# EasyEDA Pro project CH32V203 DOUBLE-FOC.epro, schematic Schematic1

## Sheets
1 P1: Board Name: CH32V203C8T6无刷双驱; Create Date: 2025-08-31; Page Name: P1; Project Name: Project; Schematic Name: Schematic1; Update Date: 2025-09-06; Company: 嘉立创EDA; Page Size: A4; Version: V1.0
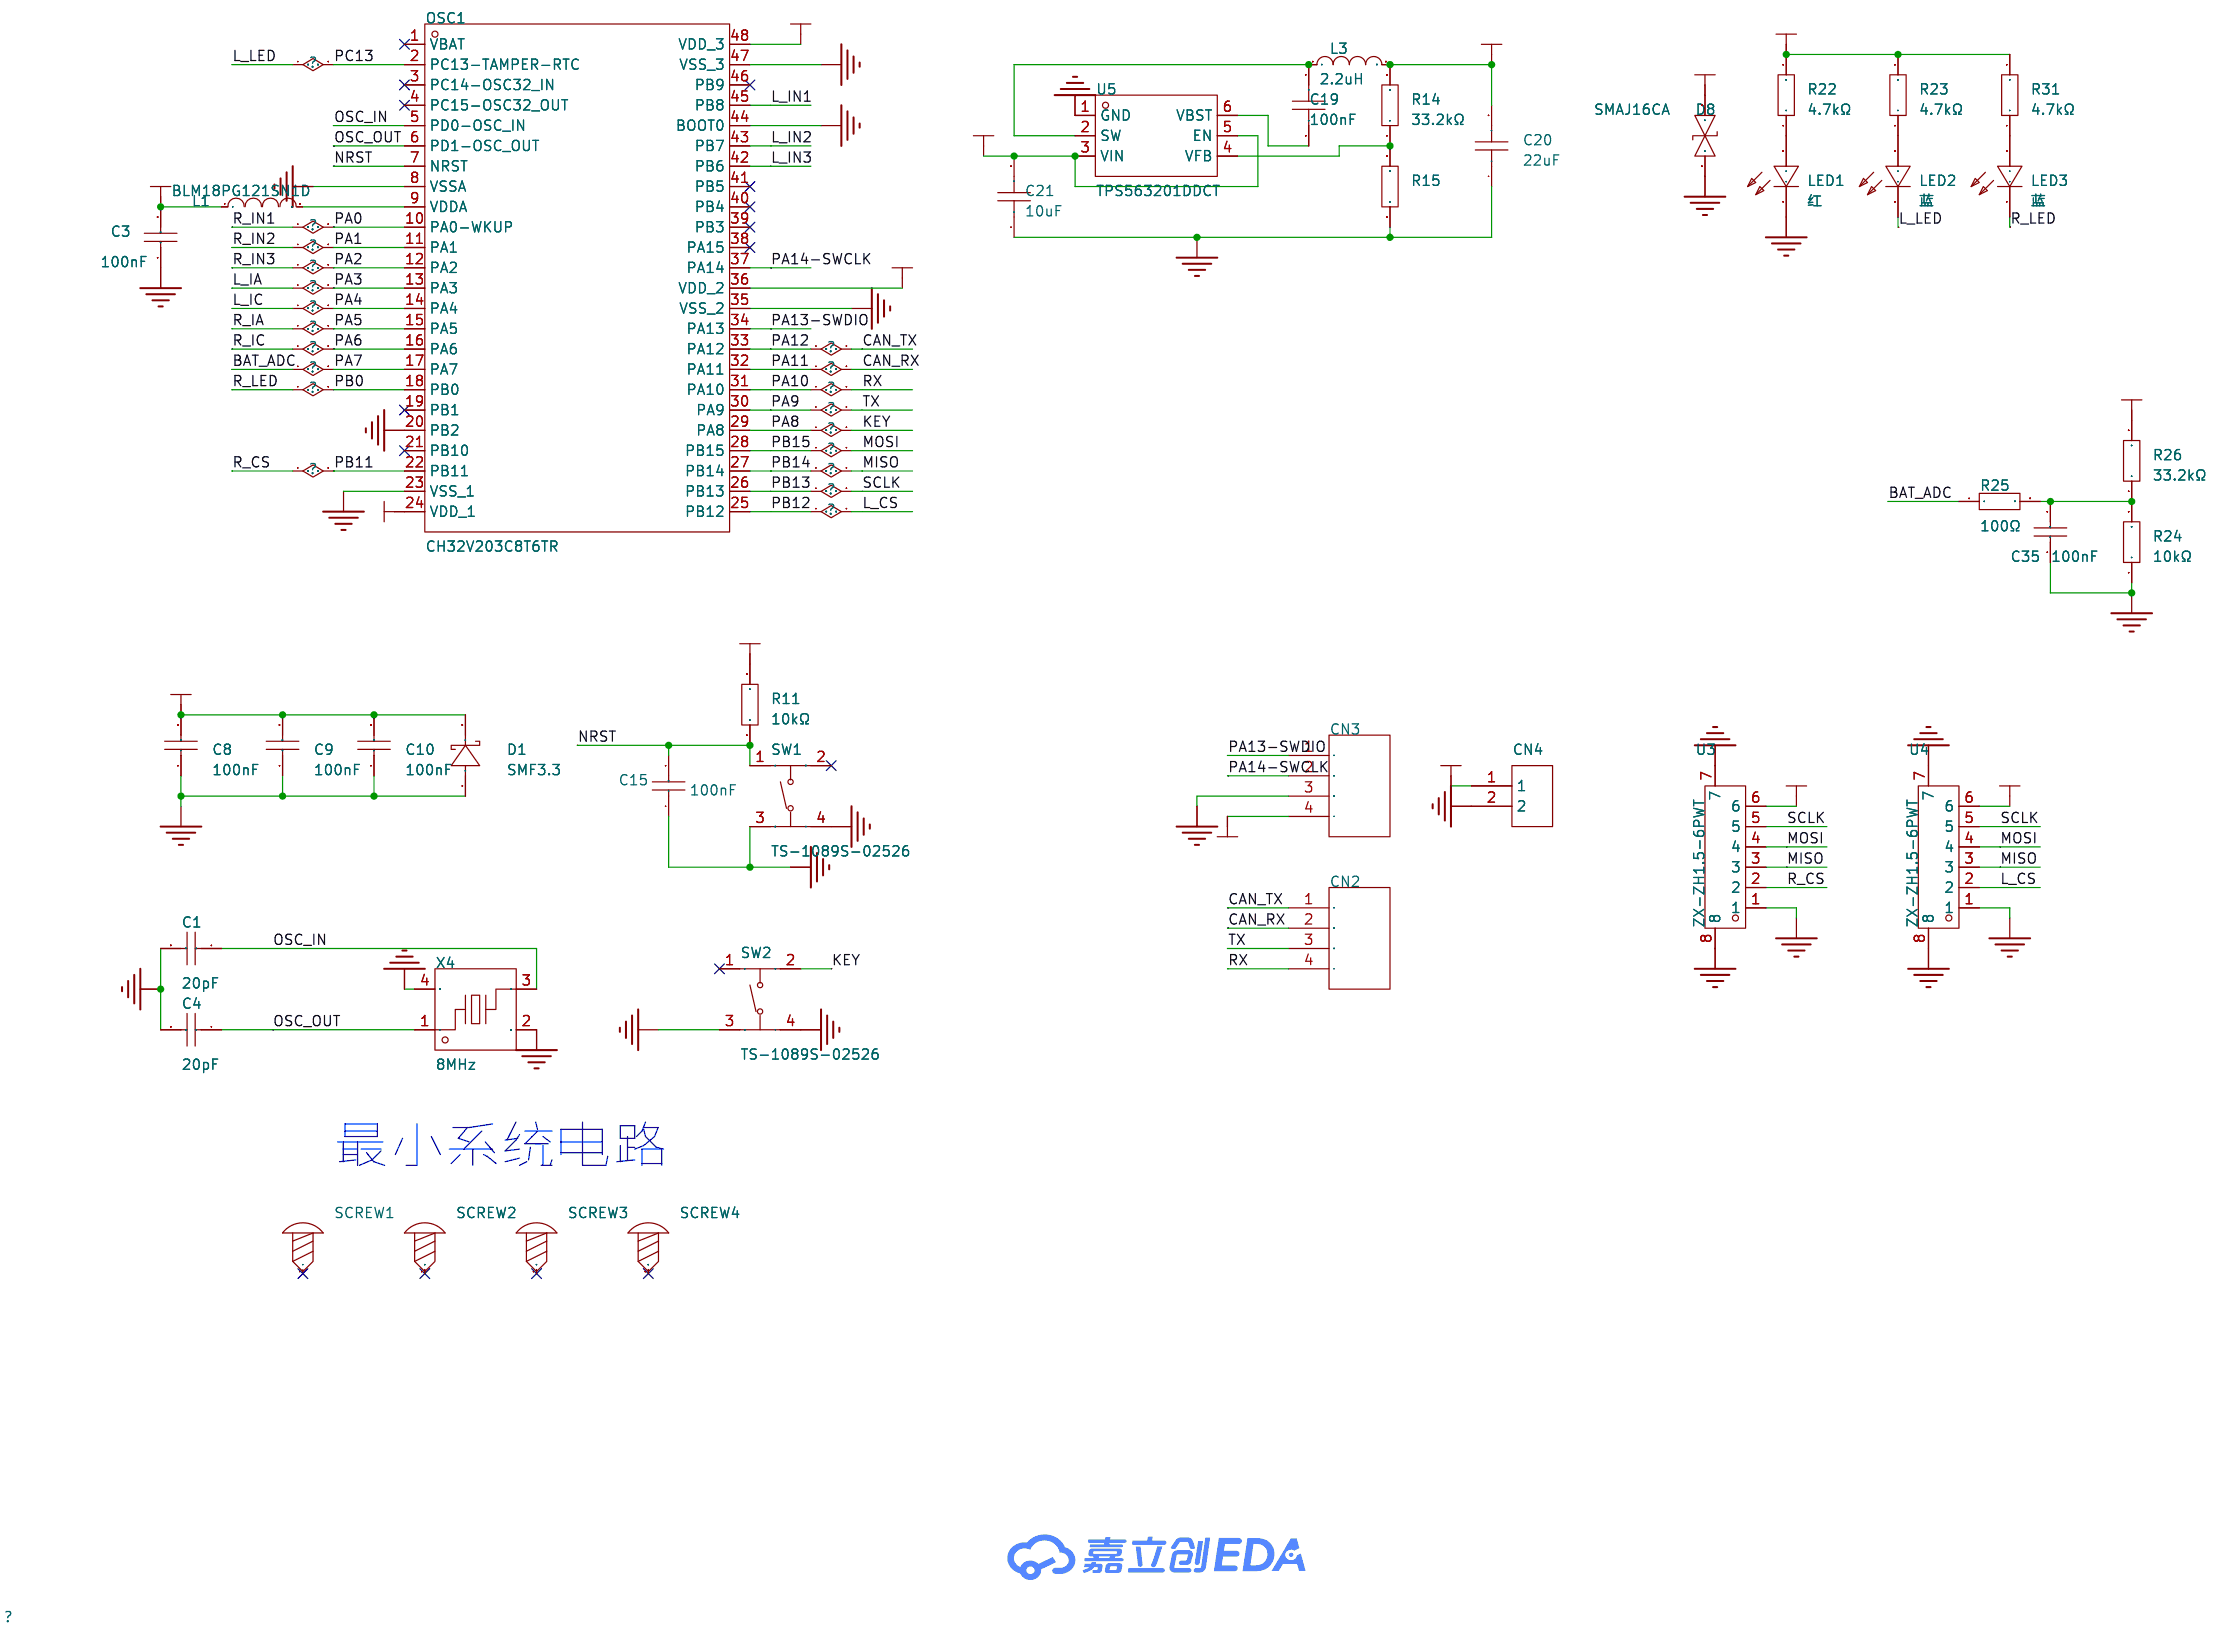
[diagram p0: P1]
2 P2: Page Name: P2; Update Date: 2025-09-01
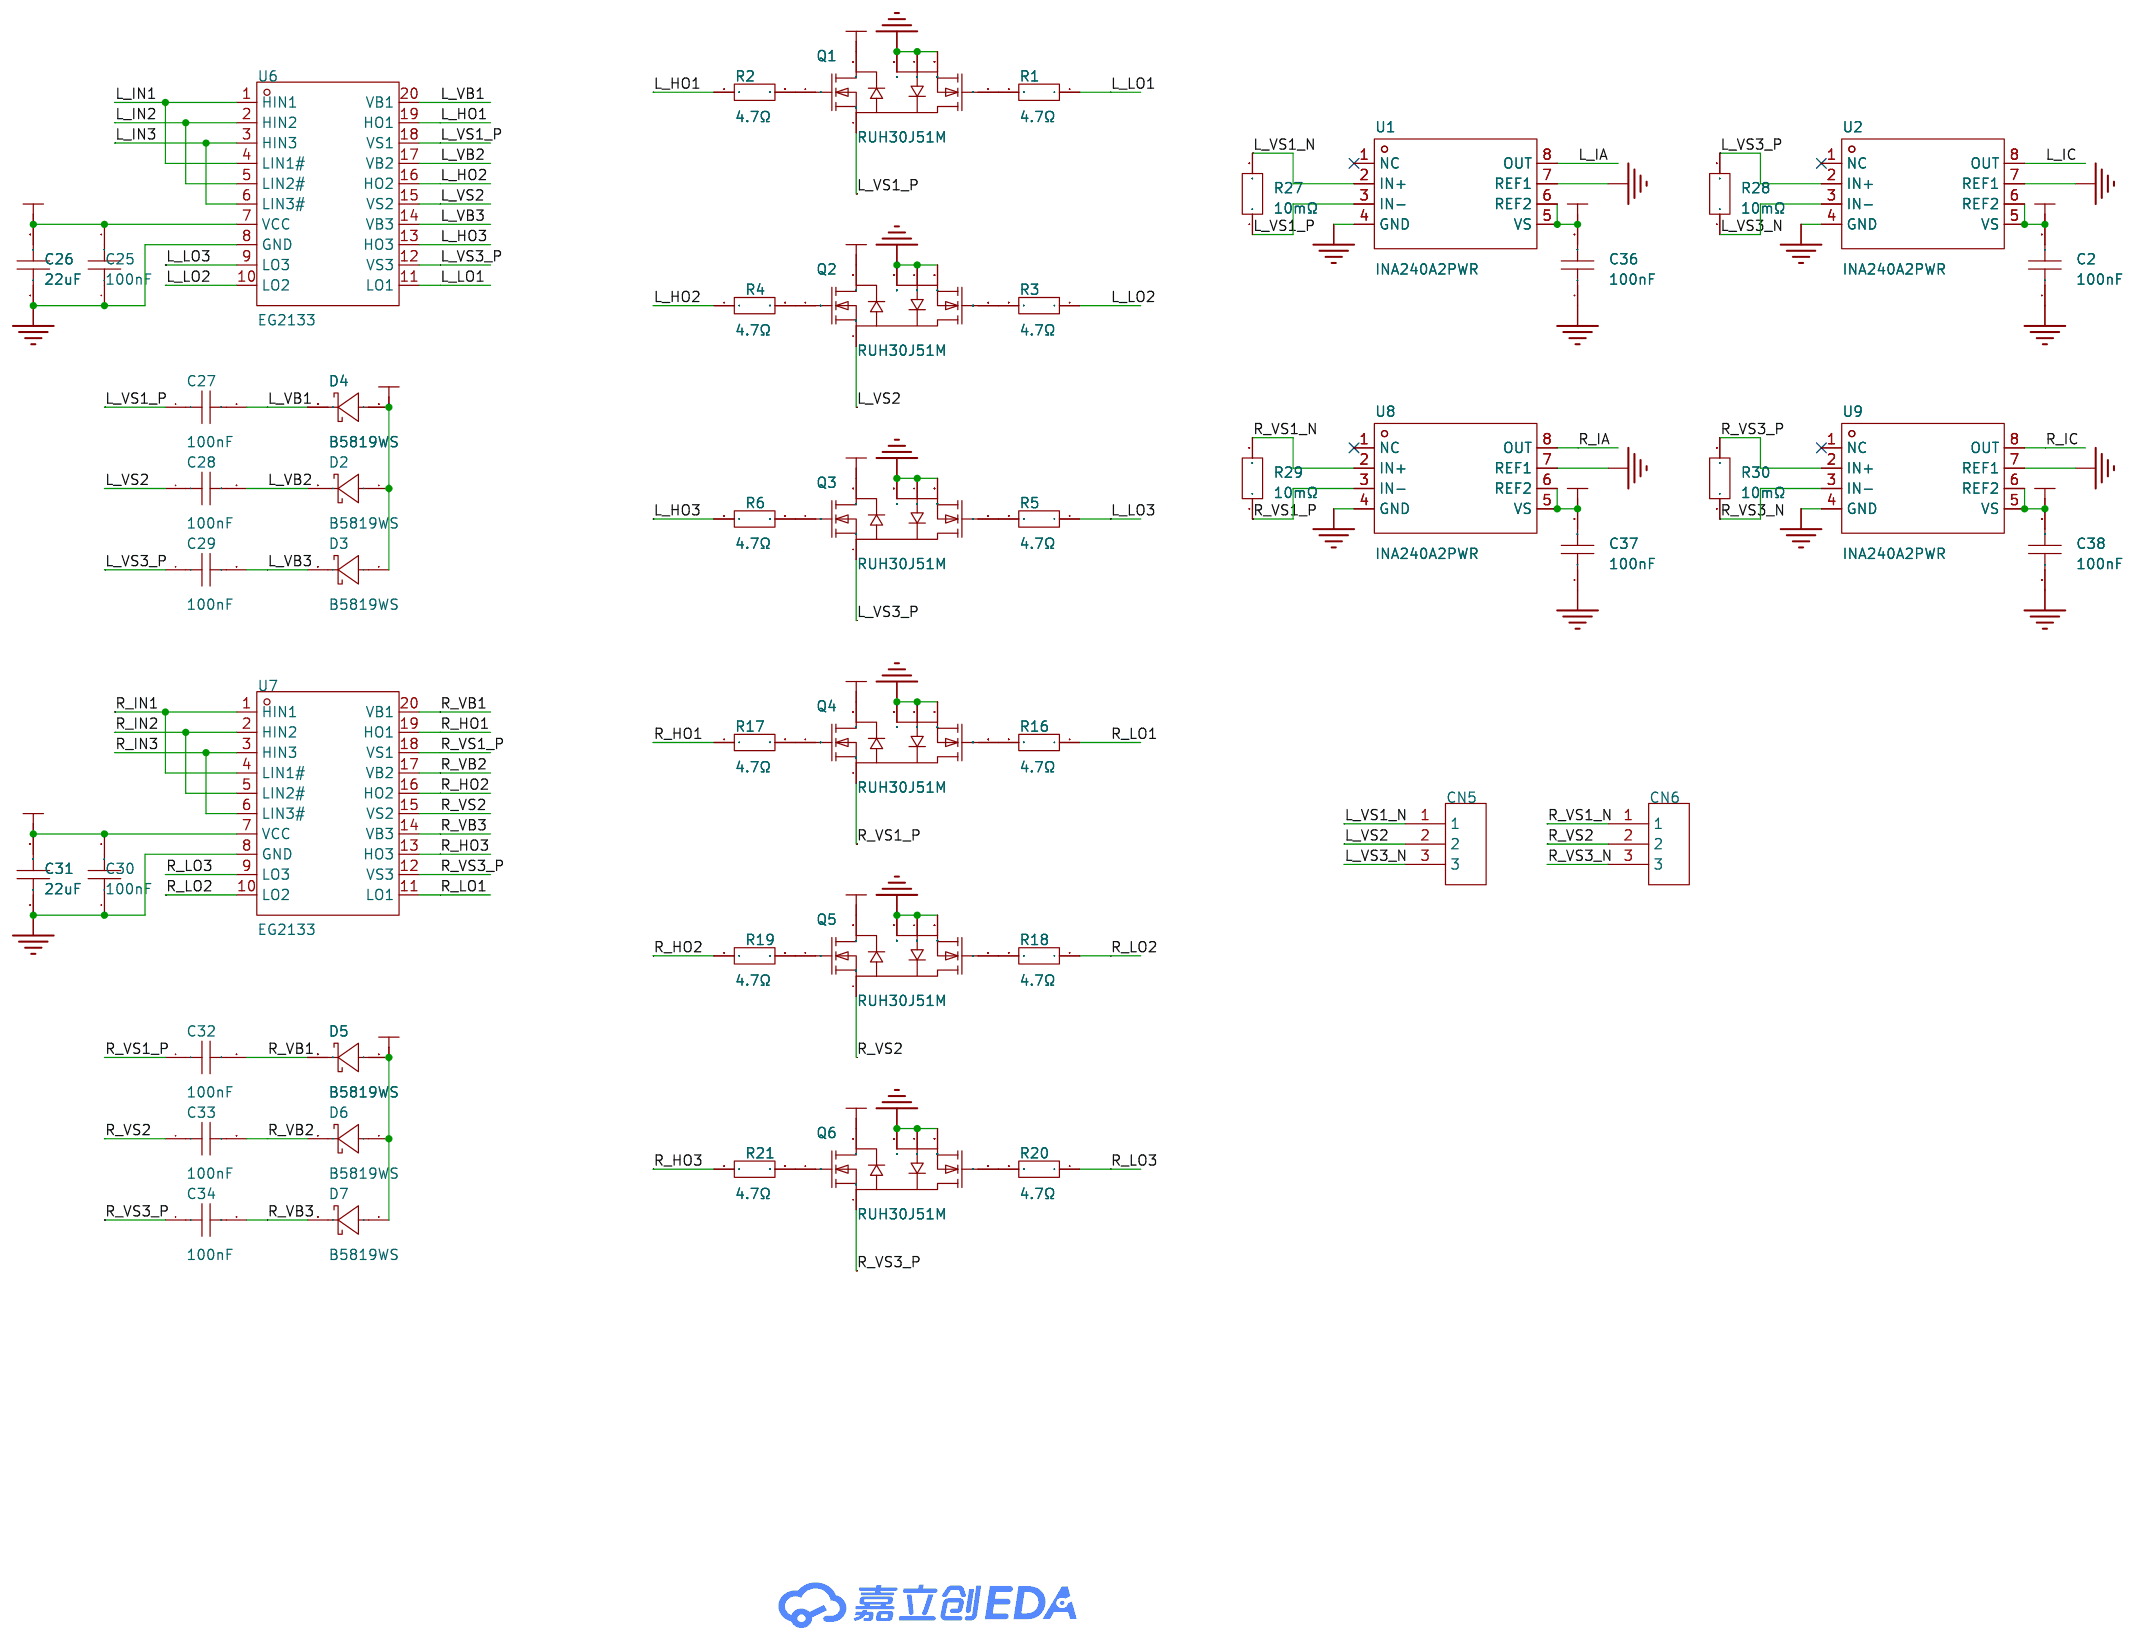
[diagram p1: P2]

## Parts
sheet P1
C1  20pF  [C0603]
C3  100nF  [C0603]
C4  20pF  [C0603]
C8  100nF  [C0603]
C9  100nF  [C0603]
C10  100nF  [C0603]
C15  100nF  [C0603]
C19  100nF  [C0603]
C20  22uF  [C0603]
C21  10uF  [C0805]
C35  100nF  [C0603]
CN2  -  [1x4P排针贴片]
CN3  -  [1x4P排针贴片]
CN4  -  [电源接口]
D1  SMF3.3  [SOD-123FL_L3.0-W1.9-LS3.7-FD]
D8  SMAJ16CA  [SMA_L4.4-W2.6-LS5.0-BI]
L1  BLM18PG121SN1D  [L0603]
L3  2.2uH  [IND-SMD_L2.5-W2.0_MHCHL2520]
LED1  红  [LED0603-RD_RED]
LED2  蓝  [LED0603-RD_RED]
LED3  蓝  [LED0603-RD_RED]
OSC1  CH32V203C8T6TR  [LQFP-48_L7.0-W7.0-P0.50-LS9.0-BL]
R11  10kΩ  [R0603]
R14  33.2kΩ  [R0603]
R15  10kΩ  [R0603]
R22  4.7kΩ  [R0603]
R23  4.7kΩ  [R0603]
R24  10kΩ  [R0603]
R25  100Ω  [R0603]
R26  33.2kΩ  [R0603]
R31  4.7kΩ  [R0603]
SCREW1  -  [M3螺丝]
SCREW2  -  [M3螺丝]
SCREW3  -  [M3螺丝]
SCREW4  -  [M3螺丝]
SW1  TS-1089S-02526  [SW-SMD_4P-L4.2-W3.3-P2.15-LS5.1]
SW2  TS-1089S-02526  [SW-SMD_4P-L4.2-W3.3-P2.15-LS5.1]
U3  ZX-ZH1.5-6PWT  [CONN-SMD_6P-P1.50_ZX-ZH1.5-6PWT]
U4  ZX-ZH1.5-6PWT  [CONN-SMD_6P-P1.50_ZX-ZH1.5-6PWT]
U5  TPS563201DDCT  [TSOT-23-6_L2.9-W1.6-P0.95-LS2.8-BL]
X4  8MHz  [CRYSTAL-SMD_4P-L3.2-W2.5-BL]
sheet P2
C2  100nF  [C0603]
C25  100nF  [C0603]
C26  22uF  [C0805]
C27  100nF  [C0603]
C28  100nF  [C0603]
C29  100nF  [C0603]
C30  100nF  [C0603]
C31  22uF  [C0805]
C32  100nF  [C0603]
C33  100nF  [C0603]
C34  100nF  [C0603]
C36  100nF  [C0603]
C37  100nF  [C0603]
C38  100nF  [C0603]
CN5  -  [无刷电机接口]
CN6  -  [无刷电机接口]
D2  B5819WS  [SOD-323_L1.7-W1.3-LS2.5-FD]
D3  B5819WS  [SOD-323_L1.7-W1.3-LS2.5-FD]
D4  B5819WS  [SOD-323_L1.7-W1.3-LS2.5-FD]
D5  B5819WS  [SOD-323_L1.7-W1.3-LS2.5-FD]
D6  B5819WS  [SOD-323_L1.7-W1.3-LS2.5-FD]
D7  B5819WS  [SOD-323_L1.7-W1.3-LS2.5-FD]
Q1  RUH30J51M  [DFN-8_L6.0-W5.0-P1.27_AON6938]
Q2  RUH30J51M  [DFN-8_L6.0-W5.0-P1.27_AON6938]
Q3  RUH30J51M  [DFN-8_L6.0-W5.0-P1.27_AON6938]
Q4  RUH30J51M  [DFN-8_L6.0-W5.0-P1.27_AON6938]
Q5  RUH30J51M  [DFN-8_L6.0-W5.0-P1.27_AON6938]
Q6  RUH30J51M  [DFN-8_L6.0-W5.0-P1.27_AON6938]
R1  4.7Ω  [R0603]
R2  4.7Ω  [R0603]
R3  4.7Ω  [R0603]
R4  4.7Ω  [R0603]
R5  4.7Ω  [R0603]
R6  4.7Ω  [R0603]
R16  4.7Ω  [R0603]
R17  4.7Ω  [R0603]
R18  4.7Ω  [R0603]
R19  4.7Ω  [R0603]
R20  4.7Ω  [R0603]
R21  4.7Ω  [R0603]
R27  10mΩ  [R2512]
R28  10mΩ  [R2512]
R29  10mΩ  [R2512]
R30  10mΩ  [R2512]
U1  INA240A2PWR  [TSSOP-8_L4.4-W3.0-P0.65-LS6.4-BL]
U2  INA240A2PWR  [TSSOP-8_L4.4-W3.0-P0.65-LS6.4-BL]
U6  EG2133  [TSSOP-20_L6.5-W4.4-P0.65-LS6.4-BL]
U7  EG2133  [TSSOP-20_L6.5-W4.4-P0.65-LS6.4-BL]
U8  INA240A2PWR  [TSSOP-8_L4.4-W3.0-P0.65-LS6.4-BL]
U9  INA240A2PWR  [TSSOP-8_L4.4-W3.0-P0.65-LS6.4-BL]

## Library data of the parts
C1 C4 = CL10C200JB8NNNC: 容值:20pF;精度:±5%;额定电压:50V;材质(温度系数):C0G;; LCSC Part Name: 20pF ±5% 50V; Supplier Part: C1648; Manufacturer: SAMSUNG(三星); Supplier Footprint: 0603; JLCPCB Part Class: 基础库; Datasheet: https://atta.szlcsc.com/upload/public/pdf/source/20160218/1457707763339.pdf; Supplier: LCSC; Tolerance: ±5%; Voltage Rated: 50V; Temperature Coefficient: C0G
C3 C8-C10 C15 C35 = 0603B104K500NT: 容值:100nF;精度:±10%;额定电压:50V;材质(温度系数):X7R;; LCSC Part Name: 100nF ±10% 50V; Supplier Part: C30926; Manufacturer: FH(风华); Supplier Footprint: 0603; JLCPCB Part Class: 扩展库; Datasheet: https://atta.szlcsc.com/upload/public/pdf/source/20200305/C486355_26A10D38EF8C2A5C37091D0039909270.pdf; Supplier: LCSC; Tolerance: ±10%; Voltage Rated: 50V; Temperature Coefficient: X7R
C19 C27-C29 C32-C34 = CGA0603X7R104K500JT: 容值:100nF;精度:±10%;额定电压:50V;材质(温度系数):X7R;; LCSC Part Name: 100nF ±10% 50V; Supplier Part: C6119867; Manufacturer: HRE(芯声); Supplier Footprint: 0603; JLCPCB Part Class: 扩展库; Supplier: LCSC; Tolerance: ±10%; Voltage Rated: 50V; Temperature Coefficient: X7R
C20 = CGA0603X5R226M160JT: 容值:22uF;精度:±20%;额定电压:16V;材质(温度系数):X5R;; LCSC Part Name: 22uF ±20% 16V; Supplier Part: C6119868; Manufacturer: HRE(芯声); Supplier Footprint: 0603; JLCPCB Part Class: 扩展库; Supplier: LCSC; Tolerance: ±20%; Voltage Rated: 16V; Temperature Coefficient: X5R
C21 = GRM21BR61H106KE43L: 容值:10uF;精度:±10%;额定电压:50V;材质(温度系数):X5R;; LCSC Part Name: 10uF ±10% 50V; Supplier Part: C440198; Manufacturer: muRata(村田); Supplier Footprint: 0805; JLCPCB Part Class: 基础库; Datasheet: https://atta.szlcsc.com/upload/public/pdf/source/20230811/95AAE0C9AF55EDC31B7A4D8B733F534E.pdf; Supplier: LCSC; Tolerance: ±10%; Voltage Rated: 50V; Temperature Coefficient: X5R
CN2 CN3 = 1x4P排针贴片
CN4 = 电源接口
D1 = SMF3.3: 反向截止电压(Vrwm):3.3V;最大钳位电压:6.8V;峰值脉冲电流(Ipp)@10/1000us:30A;峰值脉冲功率(Ppp)@10/1000us:200W;击穿电压:3.4V;; Supplier Part: C2649858; Manufacturer: Littelfuse(美国力特); Supplier Footprint: SOD-123FL; JLCPCB Part Class: 扩展库; Datasheet: https://atta.szlcsc.com/upload/public/pdf/source/20210611/50E5D37DD0B56B29EBADFDB41F7ACD9C.pdf; Supplier: LCSC; Reverse Stand-Off Voltage (Vrwm): 3.3V; Maximum Clamping Voltage: 6.8V; Peak Pulse Current (Ipp)@10/1000us: 30A; Peak Pulse Power Dissipation (Ppp)@10/1000us: 200W; Breakdown Voltage: 3.4V; Type: TVS
D8 = SMAJ16CA_C148217: 反向截止电压(Vrwm):16V;最大钳位电压:26V;峰值脉冲电流(Ipp)@10/1000us:15.4A;峰值脉冲功率(Ppp)@10/1000us:400W;击穿电压:17.8V;; LCSC Part Name: 双向TVS 16V截止 15.4A峰值脉冲; Supplier Part: C148217; Manufacturer: Littelfuse(美国力特); Supplier Footprint: SMA(DO-214AC); JLCPCB Part Class: 扩展库; Datasheet: https://atta.szlcsc.com/upload/public/pdf/source/20190402/C374025_5ACE77BC72947DF13CF0CBC7F8B57228.pdf; Supplier: LCSC; Reverse Stand-Off Voltage (Vrwm): 16V; Maximum Clamping Voltage: 26V; Peak Pulse Current (Ipp)@10/1000us: 15.4A; Peak Pulse Power Dissipation (Ppp)@10/1000us: 400W; Breakdown Voltage: 17.8V; Type: TVS
L1 = BLM18PG121SN1D: 标称阻抗@测试频率:120Ω@100MHz;误差:±25%;直流电阻(RDC):50mΩ;; LCSC Part Name: 单路 0603磁珠 阻抗120Ω@100MHz; Supplier Part: C14709; Manufacturer: muRata(村田); Supplier Footprint: 0603; JLCPCB Part Class: 扩展库; Datasheet: https://atta.szlcsc.com/upload/public/pdf/source/20130704/1457706621422.pdf; Supplier: LCSC; Impedance @ Frequency: 120Ω@100MHz; Tolerance: ±25%; DC Resistance: 50mΩ; Current Rating: 2A; Circuits: 1
L3 = FTC252012S2R2MBCA: 电感值:2.2uH;精度:±20%;额定电流:3A;饱和电流(Isat):3.8A;类型:一体成型电感;; LCSC Part Name: 2.2uH ±20% 3.8A; Supplier Part: C5832372; Manufacturer: cjiang(长江微电); Supplier Footprint: 1008; JLCPCB Part Class: 扩展库; Datasheet: https://atta.szlcsc.com/upload/public/pdf/source/20230602/8FFEDA9C0247A92A0D4B67554BFE4091.pdf; Supplier: LCSC; Tolerance: ±20%; Rated Current: 3A; Saturation Current (Isat): 3.8A; DC Resistance (DCR): 55mΩ; Type: 一体成型电感
LED1-LED3 = NCD0603R1_C84263: 灯头类型:-;发光颜色:红色;正向电压(VF):1.6V~2.6V;功率:65mW;正向电流:20mA;主波长:615nm~630nm;二极管配置:独立二极管;透镜颜色:无色透明透镜;色温:-;发光强度:80mcd~220mcd;发光角度:130°;载带方式:-;工作温度:-30℃~+85℃;; LCSC Part Name: NCD0603R1; Supplier Part: C84263; Manufacturer: 国星光电; Supplier Footprint: 0603; JLCPCB Part Class: 扩展库; Datasheet: https://atta.szlcsc.com/upload/public/pdf/source/20200820/C84263_DABC6A75E58F576973B407FDBA283D60.pdf; Supplier: LCSC; Emitted Color: 红色; Forward Voltage (VF): 1.6V~2.6V; Power Dissipation: 65mW; Forward Current: 20mA; Dominant Wavelength: 615nm~630nm; Diode Configuration: 独立二极管; Lens Color: 无色透明透镜; Luminous Intensity: 80mcd~220mcd; Viewing Angle: 130°; Operating Temperature: -30℃~+85℃
OSC1 = STM32F103C8T6TR: CPU内核:CM3;程序存储容量:64KB;RAM总容量:20KB;GPIO端口数量:37;工作电压范围:2V~3.6V;CPU最大主频:72MHz;程序存储器类型:-;; Supplier Part: C2969777; Manufacturer: ST(意法半导体); Supplier Footprint: LQFP-48(7x7); JLCPCB Part Class: 扩展库; Datasheet: https://atta.szlcsc.com/upload/public/pdf/source/20220628/95EE8CB51361BFD20205E6D0986143A8.pdf; Supplier: LCSC; CPU Core: CM3; Program Storage Size: 64KB; RAM Size: 20KB; GPIO Ports Number: 37; Operating Voltage Range: 2V~3.6V; CPU Maximum Speed: 72MHz; Operating Temperature Range: -40℃~+85℃; ADC (Bit): 12bit; Universal Serial Bus: 有; Peripheral/Function: 温度传感器; Watchdog: 有; Infrared Data Association: 有; Low-Voltage Detect: 有; Direct Memory Access: 有; Internal Oscillator: 有
R11 R15 R24 = 0603WAF1002T5E: 电阻类型:厚膜电阻;阻值:10kΩ;精度:±1%;功率:100mW;最大工作电压:75V;温度系数:±100ppm/℃;; LCSC Part Name: 厚膜电阻 10kΩ ±1% 100mW; Supplier Part: C25804; Manufacturer: UNI-ROYAL(厚声); Supplier Footprint: 0603; JLCPCB Part Class: 基础库; Datasheet: https://atta.szlcsc.com/upload/public/pdf/source/20200306/C422600_1E6D84923E4A46A82E41ADD87F860B5C.pdf; Supplier: LCSC; Type: 厚膜电阻; Tolerance: ±1%; Power(Watts): 100mW; Overload Voltage (Max): 75V; Temperature Coefficient: ±100ppm/℃; Operating Temperature Range: -55℃~+155℃
R14 R26 = 0603WAF3322T5E: 电阻类型:厚膜电阻;阻值:33.2kΩ;精度:±1%;功率:100mW;最大工作电压:75V;温度系数:±100ppm/℃;; LCSC Part Name: 33.2kΩ ±1% 100mW 厚膜电阻; Supplier Part: C23003; Manufacturer: UNI-ROYAL(厚声); Supplier Footprint: 0603; JLCPCB Part Class: 扩展库; Datasheet: https://atta.szlcsc.com/upload/public/pdf/source/20200306/C422600_1E6D84923E4A46A82E41ADD87F860B5C.pdf; Supplier: LCSC; Type: 厚膜电阻; Tolerance: ±1%; Power(Watts): 100mW; Overload Voltage (Max): 75V; Temperature Coefficient: ±100ppm/℃; Operating Temperature Range: -55℃~+155℃
R22 R23 R31 = 0603WAF4701T5E: 电阻类型:厚膜电阻;阻值:4.7kΩ;精度:±1%;功率:100mW;工作电压:75V;温度系数:±100ppm/℃;; LCSC Part Name: 4.7kΩ ±1% 100mW 厚膜电阻; Supplier Part: C23162; Manufacturer: UNI-ROYAL(厚声); Supplier Footprint: 0603; JLCPCB Part Class: 基础库; Datasheet: https://item.szlcsc.com/datasheet/0603WAF4701T5E/23889.html; Supplier: LCSC; Type: 厚膜电阻; Tolerance: ±1%; Power(Watts): 100mW; Voltage-Supply(Max): 75V; Temperature Coefficient: ±100ppm/℃; Operating Temperature: -55℃~+155℃
R25 = 0603WAF1000T5E: 电阻类型:厚膜电阻;阻值:100Ω;精度:±1%;功率:100mW;最大工作电压:75V;温度系数:±200ppm/℃;; LCSC Part Name: 100Ω ±1% 100mW 厚膜电阻; Supplier Part: C22775; Manufacturer: UNI-ROYAL(厚声); Supplier Footprint: 0603; JLCPCB Part Class: 基础库; Datasheet: https://atta.szlcsc.com/upload/public/pdf/source/20200306/C422600_1E6D84923E4A46A82E41ADD87F860B5C.pdf; Supplier: LCSC; Type: 厚膜电阻; Tolerance: ±1%; Power(Watts): 100mW; Overload Voltage (Max): 75V; Temperature Coefficient: ±200ppm/℃; Operating Temperature Range: -55℃~+155℃
SCREW1-SCREW4 = M3螺丝: Supplier Footprint: 插件
SW1 SW2 = TS-1089S-02526: 电路结构:单刀单掷;按钮形状:椭圆形按钮;安装方式:立贴;开关长度:4.2mm;开关宽度:3.25mm;开关高度:2.5mm;触点电流:50mA;额定电压(DC):12V;带灯:-;机械寿命:-;; LCSC Part Name: 4.2*3.25*2.5mm 立贴 轻触开关; Supplier Part: C455282; Manufacturer: XUNPU(讯普); Supplier Footprint: SMD,3.3x4.2mm; JLCPCB Part Class: 扩展库; Datasheet: https://atta.szlcsc.com/upload/public/pdf/source/20191118/C455282_2E86A26A9CC4FEF4662951C4D45ED672.pdf; Supplier: LCSC; Circuit: 单刀单掷; Actuator Style: 椭圆形按钮; Mounting Style: 立贴; Switch Length: 4.2mm; Switch Width: 3.25mm; Switch Height: 2.5mm; Contact Current: 50mA; Voltage Rating (DC): 12V
U3 U4 = ZX-ZH1.5-6PWT: 插针结构:1x6P;间距:1.5mm;安装方式:卧贴;参考系列:ZH;总PIN数:6P;排数:1;每排PIN数:6;行距:-;额定电流:1A;触头材质:黄铜;触头镀层:锡;工作温度范围:-25℃~+85℃;; LCSC Part Name: 1x6P 间距:1.5mm 卧贴 系列:ZH; Supplier Part: C19272409; Manufacturer: Megastar(兆星); Supplier Footprint: SMD,P=1.5mm,卧贴; JLCPCB Part Class: 扩展库; Datasheet: https://atta.szlcsc.com/upload/public/pdf/source/20231201/C5A824B953C40A6060EBF5A541254C86.pdf; Supplier: LCSC; Pins Structure: 1x6P; Pitch: 1.5mm; Mounting Type: 卧贴; Reference Series: ZH; Number of Pins: 6P; Number of Rows: 1; Number of PINs Per Row: 6; Rated Current: 1A; Contact Material: 黄铜; Contact Plating: 锡; Operating Temperature: -25℃~+85℃; Rated Voltage (Max): 250V; Plastic Material: LCP; Supplementary Features: 辅助焊脚; Color: 米色; Z-Height of the Board: 3.8mm; X-Length of Bottom Edge on Board (Spacing Line): 12mm; Y-Width of Bottom Edge on Board: 6.5mm
U5 = TPS563201DDCT: 功能类型:降压型;输出类型:可调;输入电压:4.5V~17V;输出电压:768mV~7V;输出电流:3A;; Supplier Part: C2070819; Manufacturer: TI(德州仪器); Supplier Footprint: TSOT-23-6; JLCPCB Part Class: 扩展库; Datasheet: https://www.ti.com/cn/lit/gpn/tps563201; Supplier: LCSC; Function: 降压型; Output Type: 可调; Input Voltage: 4.5V~17V; Output Voltage: 768mV~7V; Output Current: 3A; Switching Frequency: 580kHz; Operating Temperature: -40℃~+125℃@(TJ); Synchronous Rectification: 是; Number of Outputs: 1; Topology: 降压式; Switch tube (built-in/external): 内置
X4 = X32258MSB4SI: 晶振类型:贴片晶振;频率:8MHz;常温频差:±10ppm;负载电容:20pF;频率稳定度:±20ppm;; LCSC Part Name: YSX321SL 8MHZ 4P 3225 20PF ±10PPM -40~85℃ (±20PPM); Supplier Part: C2682774; Manufacturer: YXC(扬兴晶振); Supplier Footprint: SMD3225-4P; JLCPCB Part Class: 扩展库; Datasheet: https://item.szlcsc.com/datasheet/X32258MSB4SI/2777871.html; Supplier: LCSC; Type: 贴片晶振; Normal temperature Frequency Tolerance: ±10ppm; Load Capacitance: 20pF; Frequency Stability: ±20ppm; Equivalent Series Resistance(ESR): 120Ω; Operating Temperature: -40℃~+85℃
C2 C25 C30 C36-C38 = CGA0603X7R104K500JT: 容值:100nF;精度:±10%;额定电压:50V;材质(温度系数):X7R;; LCSC Part Name: 100nF ±10% 50V; Supplier Part: C6119867; Manufacturer: HRE(芯声); Supplier Footprint: 0603; JLCPCB Part Class: 扩展库; Datasheet: https://atta.szlcsc.com/upload/public/pdf/source/20250103/C44077DA9E7B3EFAE02F22B6D3D1CBC9.pdf; Supplier: LCSC; Tolerance: ±10%; Voltage Rated: 50V; Temperature Coefficient: X7R; Voltage Rating: 50V
C26 C31 = CGA0805X5R226M350MT: 容值:22uF;精度:±20%;额定电压:35V;材质(温度系数):X5R;; LCSC Part Name: 22uF ±20% 35V; Supplier Part: C6119901; Manufacturer: HRE(芯声); Supplier Footprint: 0805; JLCPCB Part Class: 扩展库; Datasheet: https://atta.szlcsc.com/upload/public/pdf/source/20231129/D589D0CC4D260F7AC3A77E53B455CCB3.pdf; Supplier: LCSC; Tolerance: ±20%; Voltage Rated: 35V; Temperature Coefficient: X5R
CN5 CN6 = 无刷电机接口
D2-D7 = B5819WS_C7420331: 二极管配置:独立式;正向压降(Vf):600mV@1.0A;直流反向耐压(Vr):40V;整流电流:1A;; LCSC Part Name: 电压:40V 电流:1A; Supplier Part: C7420331; Manufacturer: 宏迦橙; Supplier Footprint: SOD-323; JLCPCB Part Class: 扩展库; Datasheet: https://atta.szlcsc.com/upload/public/pdf/source/20230828/03CA0F4F90DAE368A7153B7B5E4D0651.pdf; Supplier: LCSC; Diode Configuration: 独立式; Forward Voltage (Vf@If): 600mV@1.0A; Reverse Voltage (Vr): 40V; Rectified Current: 1A; Reverse Leakage Current (Ir): 1mA@40V
Q1-Q6 = RUH30J51M: 漏源电压(Vdss):30V;连续漏极电流(Id):50A;导通电阻(RDS(on)):7mΩ@4.5V;耗散功率(Pd):13W;阈值电压(Vgs(th)):2.5V@250uA;; LCSC Part Name: 双通道对称N沟道MOSFET,电流:50A,耐压:30V; Supplier Part: C3019595; Manufacturer: Ruichips(锐骏半导体); Supplier Footprint: DFN-8(5x6); JLCPCB Part Class: 扩展库; Datasheet: https://atta.szlcsc.com/upload/public/pdf/source/20220614/0174D7ED654B176846E53ECDED748663.pdf; Supplier: LCSC; Drain to Source Voltage: 30V; Current - Continuous Drain(Id): 50A; RDS(on): 7mΩ@4.5V; Pd - Power Dissipation: 13W; Gate Threshold Voltage (Vgs(th)): 2.5V@250uA; Gate Charge(Qg): 24nC@10V; Input Capacitance(Ciss): 580pF; Reverse Transfer Capacitance (Crss@Vds): 23pF; Output Capacitance(Coss): 195pF
R1-R6 R16-R21 = 0603WAF470KT5E: 电阻类型:厚膜电阻;阻值:4.7Ω;精度:±1%;功率:100mW;最大工作电压:75V;温度系数:±400ppm/℃;; LCSC Part Name: 4.7Ω ±1% 100mW 厚膜电阻; Supplier Part: C23164; Manufacturer: UNI-ROYAL(厚声); Supplier Footprint: 0603; JLCPCB Part Class: 基础库; Datasheet: https://atta.szlcsc.com/upload/public/pdf/source/20200306/C422600_1E6D84923E4A46A82E41ADD87F860B5C.pdf; Supplier: LCSC; Type: 厚膜电阻; Tolerance: ±1%; Power(Watts): 100mW; Overload Voltage (Max): 75V; Temperature Coefficient: ±400ppm/℃; Operating Temperature Range: -55℃~+155℃
R27-R30 = RE2512F3R010: 电阻类型:采样电阻；合金电阻;阻值:10mΩ;精度:±1%;功率:3W;温度系数:±50ppm/℃;; LCSC Part Name: 10mΩ 3W 2512 ±1%; Supplier Part: C46961753; Manufacturer: 捷而瑞; Supplier Footprint: 2512; JLCPCB Part Class: 扩展库; Datasheet: https://atta.szlcsc.com/upload/public/pdf/source/20250325/401775B85EF7B3A580BC34DFED100CB2.pdf; Supplier: LCSC; Type: 采样电阻；合金电阻; Tolerance: ±1%; Power(Watts): 3W; Temperature Coefficient: ±50ppm/℃
U1 U2 U8 U9 = INA240A2PWR: 放大器数:单路;; Supplier Part: C129949; Manufacturer: TI(德州仪器); Supplier Footprint: TSSOP-8; JLCPCB Part Class: 扩展库; Datasheet: https://www.ti.com/cn/lit/gpn/ina240; Supplier: LCSC; Number of Channels: 单路; Supply Current: 1.8mA; Operating Temperature: -40℃~+125℃
U6 U7 = EG2133: 驱动配置:三相；半桥;负载类型:MOSFET；IGBT;灌电流(IOL):1.4A;拉电流(IOH):1.2A;工作电压:4.5V~20V;上升时间(tr):25ns;下降时间(tf):20ns;; LCSC Part Name: 三相独立半桥驱动芯片; Supplier Part: C405330; Manufacturer: EG(屹晶微); Supplier Footprint: TSSOP-20; JLCPCB Part Class: 扩展库; Datasheet: https://item.szlcsc.com/datasheet/EG2133/393111.html; Supplier: LCSC; Driven Configuration: 三相；半桥; Load Type: MOSFET；IGBT; Current - Output Low(IOL): 1.4A; Current - Output High(IOH): 1.2A; Voltage - Supply: 4.5V~20V; Rise Time: 25ns; Fall Time: 20ns; Operating Temperature: -40℃~+125℃; Input Logic Level - Low: -300mV~1V

## Nets
3.3V: C2.2 C3.2 C8.2 C9.2 C10.2 C20.2 C36.2 C37.2 C38.2 CN3.4 D1.2(K) L1.1 L3.2 OSC1.24(VDD_1) OSC1.36(VDD_2) OSC1.48(VDD_3) R11.2 R14.2 R22.2 R23.2 R31.2 U1.5(VS) U1.6(REF2) U2.5(VS) U2.6(REF2) U3.6 U4.6 U8.5(VS) U8.6(REF2) U9.5(VS) U9.6(REF2)
GND: C1.2 C2.1 C3.1 C4.2 C8.1 C9.1 C10.1 C15.1 C20.1 C21.1 C25.1 C26.1 C30.1 C31.1 C35.1 C36.1 C37.1 C38.1 CN3.3 CN4.2 D1.1(A) D8.1 LED1.1(K) OSC1.8(VSSA) OSC1.20(PB2) OSC1.23(VSS_1) OSC1.35(VSS_2) OSC1.44(BOOT0) OSC1.47(VSS_3) Q1.3(S2) Q1.4(S2) Q1.5(S2) Q2.3(S2) Q2.4(S2) Q2.5(S2) Q3.3(S2) Q3.4(S2) Q3.5(S2) Q4.3(S2) Q4.4(S2) Q4.5(S2) Q5.3(S2) Q5.4(S2) Q5.5(S2) Q6.3(S2) Q6.4(S2) Q6.5(S2) R15.1 R24.1 SW1.3 SW1.4 SW2.3 SW2.4 U1.4(GND) U1.7(REF1) U2.4(GND) U2.7(REF1) U3.1 U3.7 U3.8 U4.1 U4.7 U4.8 U5.1(GND) U6.8(GND) U7.8(GND) U8.4(GND) U8.7(REF1) U9.4(GND) U9.7(REF1) X4.2(GND) X4.4(GND)
VIN: C21.2 C25.2 C26.2 C30.2 C31.2 CN4.1 D2.1(A) D3.1(A) D4.1(A) D5.1(A) D6.1(A) D7.1(A) D8.2 Q1.2(D1) Q2.2(D1) Q3.2(D1) Q4.2(D1) Q5.2(D1) Q6.2(D1) R26.2 U5.3(VIN) U5.5(EN) U6.7(VCC) U7.7(VCC)
BAT_ADC: OSC1.17(PA7) R25.1
CAN_RX: CN2.2 OSC1.32(PA11)
CAN_TX: CN2.1 OSC1.33(PA12)
KEY: OSC1.29(PA8) SW2.2
L_CS: OSC1.25(PB12) U4.2
L_HO1: R2.1 U6.19(HO1)
L_HO2: R4.1 U6.16(HO2)
L_HO3: R6.1 U6.13(HO3)
L_IA: OSC1.13(PA3) U1.8(OUT)
L_IC: OSC1.14(PA4) U2.8(OUT)
L_IN1: OSC1.45(PB8) U6.1(HIN1) U6.4(LIN1#)
L_IN2: OSC1.43(PB7) U6.2(HIN2) U6.5(LIN2#)
L_IN3: OSC1.42(PB6) U6.3(HIN3) U6.6(LIN3#)
L_LED: LED2.1(K) OSC1.2(PC13-TAMPER-RTC)
L_LO1: R1.1 U6.11(LO1)
L_LO2: R3.1 U6.10(LO2)
L_LO3: R5.1 U6.9(LO3)
L_VB1: C27.2 D4.2(K) U6.20(VB1)
L_VB2: C28.2 D2.2(K) U6.17(VB2)
L_VB3: C29.2 D3.2(K) U6.14(VB3)
L_VS1_N: CN5.1 R27.2 U1.2(IN+)
L_VS1_P: C27.1 Q1.7(S1/D2) R27.1 U1.3(IN-) U6.18(VS1)
L_VS2: C28.1 CN5.2 Q2.7(S1/D2) U6.15(VS2)
L_VS3_N: CN5.3 R28.1 U2.3(IN-)
L_VS3_P: C29.1 Q3.7(S1/D2) R28.2 U2.2(IN+) U6.12(VS3)
MISO: OSC1.27(PB14) U3.3 U4.3
MOSI: OSC1.28(PB15) U3.4 U4.4
NRST: C15.2 OSC1.7(NRST) R11.1 SW1.1
OSC_IN: C1.1 OSC1.5(PD0-OSC_IN) X4.3
OSC_OUT: C4.1 OSC1.6(PD1-OSC_OUT) X4.1
PA0: OSC1.10(PA0-WKUP) U7.1(HIN1) U7.4(LIN1#)
PA1: OSC1.11(PA1) U7.2(HIN2) U7.5(LIN2#)
PA2: OSC1.12(PA2) U7.3(HIN3) U7.6(LIN3#)
PA5: OSC1.15(PA5) U8.8(OUT)
PA6: OSC1.16(PA6) U9.8(OUT)
PA9: CN2.3 OSC1.30(PA9)
PA10: CN2.4 OSC1.31(PA10)
PA13-SWDIO: CN3.1 OSC1.34(PA13)
PA14-SWCLK: CN3.2 OSC1.37(PA14)
PB0: LED3.1(K) OSC1.18(PB0)
PB11: OSC1.22(PB11) U3.2
PB13: OSC1.26(PB13) U3.5 U4.5
R_HO1: R17.1 U7.19(HO1)
R_HO2: R19.1 U7.16(HO2)
R_HO3: R21.1 U7.13(HO3)
R_LO1: R16.1 U7.11(LO1)
R_LO2: R18.1 U7.10(LO2)
R_LO3: R20.1 U7.9(LO3)
R_VB1: C32.2 D5.2(K) U7.20(VB1)
R_VB2: C33.2 D6.2(K) U7.17(VB2)
R_VB3: C34.2 D7.2(K) U7.14(VB3)
R_VS1_N: CN6.1 R29.2 U8.2(IN+)
R_VS1_P: C32.1 Q4.7(S1/D2) R29.1 U7.18(VS1) U8.3(IN-)
R_VS2: C33.1 CN6.2 Q5.7(S1/D2) U7.15(VS2)
R_VS3_N: CN6.3 R30.1 U9.3(IN-)
R_VS3_P: C34.1 Q6.7(S1/D2) R30.2 U7.12(VS3) U9.2(IN+)
$1N1738: L1.2 OSC1.9(VDDA)
$1N2066: C19.1 L3.1 U5.2(SW)
$1N2071: R14.1 R15.2 U5.4(VFB)
$1N2073: C19.2 U5.6(VBST)
$1N4096: LED1.2(A) R22.1
$1N4567: LED2.2(A) R23.1
$1N4859: C35.2 R24.2 R25.2 R26.1
$1N15368: LED3.2(A) R31.1
$2N1901: Q2.1(G1) R4.2
$2N1906: Q3.1(G1) R6.2
$2N1991: Q1.1(G1) R2.2
$2N2000: Q3.6(G2) R5.2
$2N2001: Q2.6(G2) R3.2
$2N2002: Q1.6(G2) R1.2
$2N2874: Q6.1(G1) R21.2
$2N2880: Q5.1(G1) R19.2
$2N2881: Q4.1(G1) R17.2
$2N2957: Q6.6(G2) R20.2
$2N2960: Q5.6(G2) R18.2
$2N2963: Q4.6(G2) R16.2

Not connected (* = marked no-connect by the designer): OSC1 1(VBAT)* 3(PC14-OSC32_IN)* 4(PC15-OSC32_OUT)* 19(PB1)* 21(PB10)* 38(PA15)* 39(PB3)* 40(PB4)* 41(PB5)* 46(PB9)*; SCREW1 1*; SCREW2 1*; SCREW3 1*; SCREW4 1*; SW1 2*; SW2 1*; U1 1(NC)*; U2 1(NC)*; U8 1(NC)*; U9 1(NC)*

## Notes on the sheets
sheet 1
- 最小系统电路
